# EAGLE schematic BreadBoard (EAGLE 6.4)
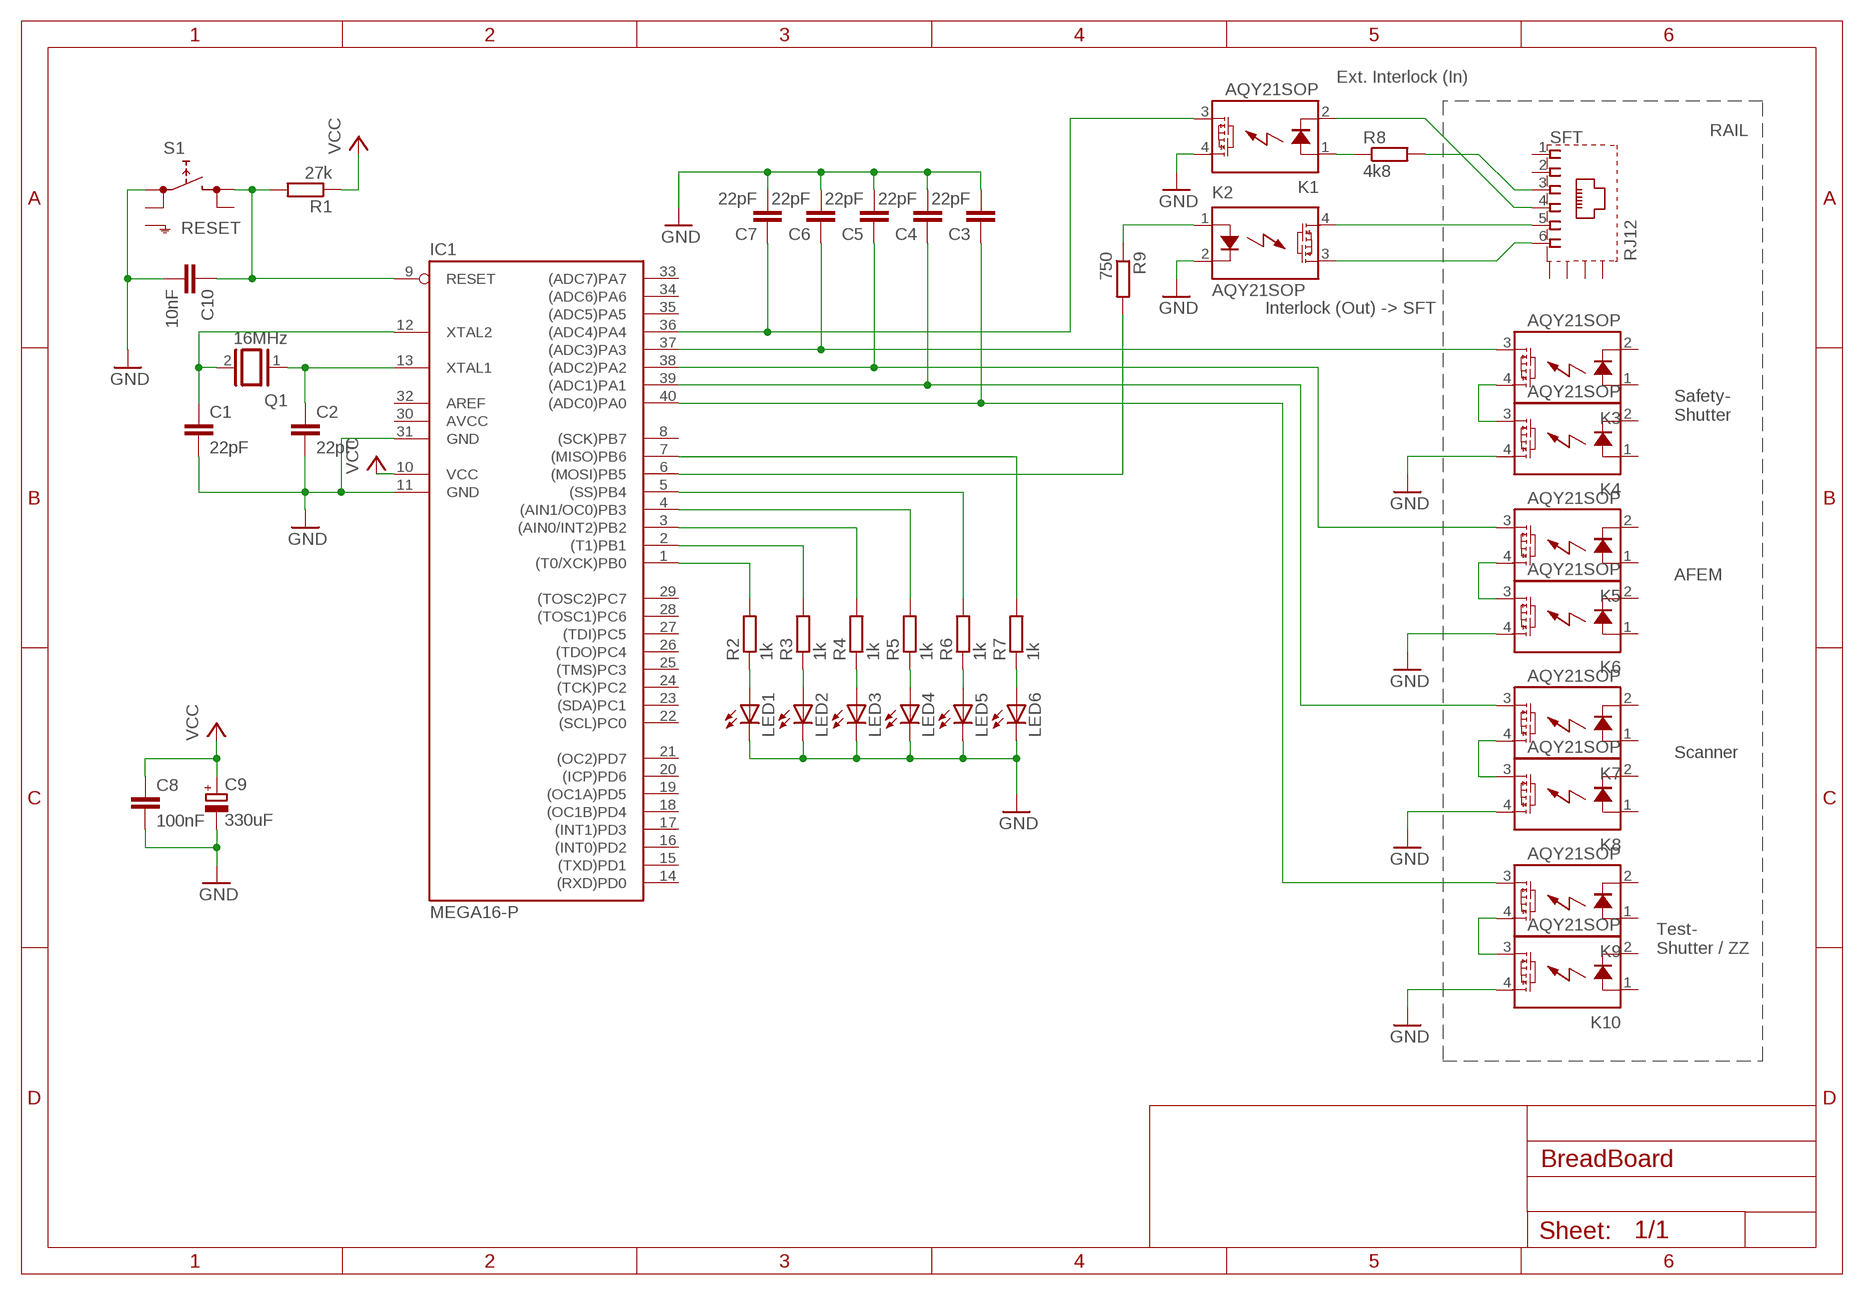
[diagram p0: schematic, sheet 1]

## Parts
C1  22pF  C-EU025-025X050  [C025-025X050]
C2  22pF  C-EU025-025X050  [C025-025X050]
C3  22pF  C-EU025-025X050  [C025-025X050]
C4  22pF  C-EU025-025X050  [C025-025X050]
C5  22pF  C-EU025-025X050  [C025-025X050]
C6  22pF  C-EU025-025X050  [C025-025X050]
C7  22pF  C-EU025-025X050  [C025-025X050]
C8  100nF  C-EU025-025X050  [C025-025X050]
C9  330uF  CPOL-EUE2.5-7  [E2,5-7]
C10  10nF  C-EU025-025X050  [C025-025X050]
IC1  MEGA16-P  [DIL40]
K1  AQY21SOP  [SOP04]
K2  AQY21SOP  [SOP04]
K3  AQY21SOP  [SOP04]
K4  AQY21SOP  [SOP04]
K5  AQY21SOP  [SOP04]
K6  AQY21SOP  [SOP04]
K7  AQY21SOP  [SOP04]
K8  AQY21SOP  [SOP04]
K9  AQY21SOP  [SOP04]
K10  AQY21SOP  [SOP04]
LED1  LED3MM  [LED3MM]
LED2  LED3MM  [LED3MM]
LED3  LED3MM  [LED3MM]
LED4  LED3MM  [LED3MM]
LED5  LED3MM  [LED3MM]
LED6  LED3MM  [LED3MM]
Q1  16MHz  XTAL  [Q]
R1  27k  R-EU_0411/15  [0411/15]
R2  1k  R-EU_0411/15  [0411/15]
R3  1k  R-EU_0411/15  [0411/15]
R4  1k  R-EU_0411/15  [0411/15]
R5  1k  R-EU_0411/15  [0411/15]
R6  1k  R-EU_0411/15  [0411/15]
R7  1k  R-EU_0411/15  [0411/15]
R8  4k8  R-EU_0411/15  [0411/15]
R9  750  R-EU_0411/15  [0411/15]
S1  RESET  SKHMPSE010  [SKHMPXE010]
SFT  RJ12  RJ11-6L2-S  [RJ11-SHIELD2]

## Nets
GND: C1.2 C2.2 C3.2 C4.2 C5.2 C6.2 C7.2 C8.2 C9.- C10.2 IC1.11(GND) IC1.31(GND) K1.4(DS1) K2.2(K) K4.4(DS1) K6.4(DS1) K8.4(DS1) K10.4(DS1) LED1.K(C) LED2.K(C) LED3.K(C) LED4.K(C) LED5.K(C) LED6.K(C) S1.1(1.1)
N$1: C1.1 IC1.12(XTAL2) Q1.2
N$2: C2.1 IC1.13(XTAL1) Q1.1
N$3: IC1.1((T0/XCK)PB0) R2.2
N$4: K2.4(DS1) SFT.5
N$5: C10.1 IC1.9(RESET) R1.2 S1.3(2.1)
N$6: C7.1 IC1.36((ADC4)PA4) K1.3(DS2)
N$7: K3.4(DS1) K4.3(DS2)
N$8: C3.1 IC1.40((ADC0)PA0) K9.3(DS2)
N$9: K5.4(DS1) K6.3(DS2)
N$10: K7.4(DS1) K8.3(DS2)
N$11: K9.4(DS1) K10.3(DS2)
N$12: C4.1 IC1.39((ADC1)PA1) K7.3(DS2)
N$13: IC1.2((T1)PB1) R3.2
N$14: LED1.A R2.1
N$15: LED2.A R3.1
N$16: LED3.A R4.1
N$17: LED4.A R5.1
N$18: LED5.A R6.1
N$19: LED6.A R7.1
N$20: C5.1 IC1.38((ADC2)PA2) K5.3(DS2)
N$21: K2.3(DS2) SFT.6
N$22: IC1.3((AIN0/INT2)PB2) R4.2
N$23: IC1.4((AIN1/OC0)PB3) R5.2
N$24: IC1.5((SS)PB4) R6.2
N$25: IC1.7((MISO)PB6) R7.2
N$26: C6.1 IC1.37((ADC3)PA3) K3.3(DS2)
N$27: R8.2 SFT.3
N$28: K2.1(A) R9.1
N$29: K1.1(A) R8.1
N$30: IC1.6((MOSI)PB5) R9.2
N$31: K1.2(K) SFT.4
VCC: C8.1 C9.+ IC1.10(VCC) R1.1
Unconnected: IC1.8((SCK)PB7) IC1.14((RXD)PD0) IC1.15((TXD)PD1) IC1.16((INT0)PD2) IC1.17((INT1)PD3) IC1.18((OC1B)PD4) IC1.19((OC1A)PD5) IC1.20((ICP)PD6) IC1.21((OC2)PD7) IC1.22((SCL)PC0) IC1.23((SDA)PC1) IC1.24((TCK)PC2) IC1.25((TMS)PC3) IC1.26((TDO)PC4) IC1.27((TDI)PC5) IC1.28((TOSC1)PC6) IC1.29((TOSC2)PC7) IC1.32(AREF) IC1.33((ADC7)PA7) IC1.34((ADC6)PA6) IC1.35((ADC5)PA5) K3.1(A) K3.2(K) K4.1(A) K4.2(K) K5.1(A) K5.2(K) K6.1(A) K6.2(K) K7.1(A) K7.2(K) K8.1(A) K8.2(K) K9.1(A) K9.2(K) K10.1(A) K10.2(K) S1.2(1.2) S1.4(2.2) S1.5(SH) SFT.1 SFT.2 SFT.S1(S) SFT.S2(S) SFT.S3(S) SFT.S4(S)

## Notes on the sheet
- Ext. Interlock (In)
- RAIL
- Interlock (Out) -> SFT
- Safety-
  Shutter
- AFEM
- Scanner
- Test-
  Shutter / ZZ

## Power pins joined to a net without a drawn wire
AVCC: IC1.30(AVCC)

## Library data of the parts
C1-C8 C10 = rcl:C-EU: CAPACITOR, European symbol
C9 = rcl:CPOL-EU: POLARIZED CAPACITOR, European symbol
IC1 = atmel:MEGA16-P: MICROCONTROLLER 16 Kbytes FLASH 1 kbytes SRAM 512 bytes EEPROM USART 8-channel 10 bit ADC Source: avr.lbr; MPN: ATMEGA16-16PU; OC_FARNELL: 9171142; OC_NEWARK: 01M6885
K1-K10 = relay:AQY*: PhotoMOS Relay NAiS Source: http://www.panasonic-electric-works.com/catalogues/downloads/photomos/ds_x615_en_aqz10_20.pdf; OC_FARNELL: unknown; OC_NEWARK: unknown
LED1-LED6 = led:LED: LED OSRAM: - CHIPLED LG R971, LG N971, LY N971, LG Q971, LY Q971, LO R971, LY R971 LH N974, LH R974 LS Q976, LO Q976, LY Q976 LO Q996 - Hyper CHIPLED LW Q18S LB Q993, LB Q99A, LB R99A - SideLED LS A670, LO A670, LY A670, LG A670, LP A670 LB A673, LV A673, LT A673, LW A673 LH A674 LY A675 LS A676, LA A676, LO A676, LY A676, LW A676 LS A679, LY A679, LG A679 - Hyper Micro SIDELED® LS Y876, LA Y876, LO Y876, LY Y876 LT Y87S - SmartLED LW L88C, LW L88S LB L89C, LB L89S, LG L890 LS L89K, LO L89K, LY L89K LS L896, LA L896, LO L896, LY L896 - TOPLED LS T670, LO T670, LY T670, LG T670, LP T670 LSG T670, LSP T670, LSY T670, LOP T670, LYG T670 LG T671, LOG T671, LSG T671 LB T673, LV T673, LT T673, LW T673 LH T674 LS T676, LA T676, LO T676, LY T676, LB T676, LH T676, LSB T676, LW T676 LB T67C, LV T67C, LT T67C, LS T67K, LO T67K, LY T67K, LW E67C LS E67B, LA E67B, LO E67B, LY E67B, LB E67C, LV E67C, LT E67C LW T67C LS T679, LY T679, LG T679 LS T770, LO T770, LY T770, LG T770, LP T770 LB T773, LV T773, LT T773, LW T773 LH T774 LS E675, LA E675, LY E675, LS T675 LS T776, LA T776, LO T776, LY T776, LB T776 LHGB T686 LT T68C, LB T68C - Hyper Mini TOPLED® LB M676 - Mini TOPLED Santana® LG M470 LS M47K, LO M47K, LY M47K Source: http://www.osram.convergy.de LUXEON: - LUMILED® LXK2-PW12-R00, LXK2-PW12-S00, LXK2-PW14-U00, LXK2-PW14-V00 LXK2-PM12-R00, LXK2-PM12-S00, LXK2-PM14-U00 LXK2-PE12-Q00, LXK2-PE12-R00, LXK2-PE12-S00, LXK2-PE14-T00, LXK2-PE14-U00 LXK2-PB12-K00, LXK2-PB12-L00, LXK2-PB12-M00, LXK2-PB14-N00, LXK2-PB14-P00, LXK2-PB14-Q00 LXK2-PR12-L00, LXK2-PR12-M00, LXK2-PR14-Q00, LXK2-PR14-R00 LXK2-PD12-Q00, LXK2-PD12-R00, LXK2-PD12-S00 LXK2-PH12-R00, LXK2-PH12-S00 LXK2-PL12-P00, LXK2-PL12-Q00, LXK2-PL12-R00 Source: www.luxeon.com KINGBRIGHT: KA-3528ASYC Source: www.kingbright.com
Q1 = special:XTAL: CRYSTAL
R1-R9 = rcl:R-EU_: RESISTOR, European symbol
S1 = switch:SKHMP*E010: 6.2 X 6.5mm TACT Switch (SMD) Source: http://www3.alps.co.jp/WebObjects/catalog.woa/PDF/E/Switch/Tact/SKHM/SKHM.PDF
SFT = con-tycoelectronics:RJ11*2: RJ11 (Style 1 Shield / Style 2 Shield) Source: www.tycoelectronics.com .. ENG_DS_1654001_1099_RJ_L_0507.pdf; MF: TYCO ELECTRONICS; MPN: RJ11-6L2-S=F9181; OC_FARNELL: unknown; OC_NEWARK: 80K4730